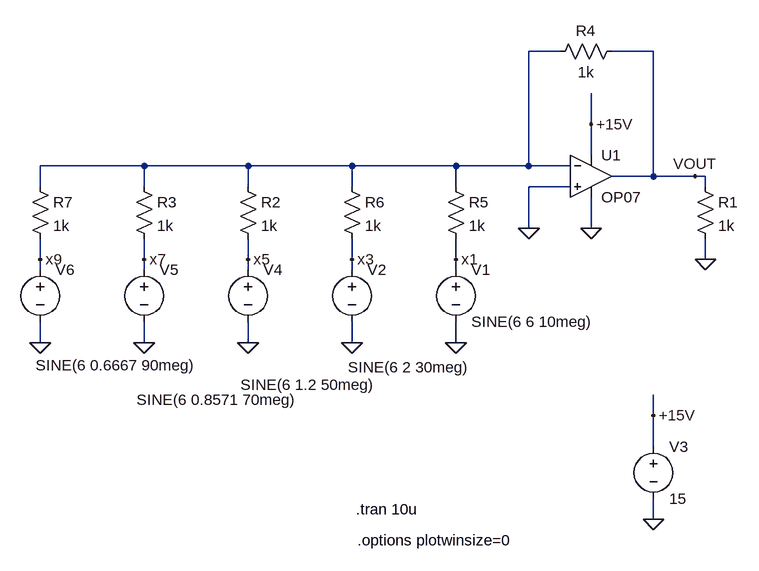
[diagram p0: schematic harmonic_04_pulse-sin.asc]
harmonic_04_pulse-sin.asc, the LTspice schematic file:
Version 4
SHEET 1 880 680
WIRE 128 -240 80 -240
WIRE 272 -240 208 -240
WIRE 176 -128 176 -176
WIRE 176 -80 176 -128
WIRE -512 -64 -672 -64
WIRE -352 -64 -512 -64
WIRE -192 -64 -352 -64
WIRE -32 -64 -192 -64
WIRE 80 -64 80 -240
WIRE 80 -64 -32 -64
WIRE 144 -64 80 -64
WIRE 272 -48 272 -240
WIRE 272 -48 208 -48
WIRE 336 -48 272 -48
WIRE 352 -48 336 -48
WIRE -672 -32 -672 -64
WIRE -512 -32 -512 -64
WIRE -352 -32 -352 -64
WIRE -192 -32 -192 -64
WIRE -32 -32 -32 -64
WIRE 144 -32 80 -32
WIRE 352 -32 352 -48
WIRE 80 32 80 -32
WIRE 176 32 176 -16
WIRE -672 80 -672 48
WIRE -512 80 -512 48
WIRE -352 80 -352 48
WIRE -192 80 -192 48
WIRE -32 80 -32 48
WIRE 352 80 352 48
WIRE -672 96 -672 80
WIRE -512 96 -512 80
WIRE -352 96 -352 80
WIRE -192 96 -192 80
WIRE -32 96 -32 80
WIRE -672 208 -672 176
WIRE -512 208 -512 176
WIRE -352 208 -352 176
WIRE -192 208 -192 176
WIRE -32 208 -32 176
WIRE 272 320 272 288
WIRE 272 368 272 320
WIRE 272 480 272 448
FLAG 352 80 0
FLAG -32 208 0
FLAG -192 208 0
FLAG 80 32 0
FLAG 272 480 0
FLAG -352 208 0
FLAG 176 -128 +15V
FLAG 272 320 +15V
FLAG 176 32 0
FLAG 336 -48 VOUT
FLAG -512 208 0
FLAG -672 208 0
FLAG -32 80 x1
FLAG -192 80 x3
FLAG -352 80 x5
FLAG -512 80 x7
FLAG -672 80 x9
SYMBOL voltage -32 80 R0
WINDOW 123 0 0 Left 0
WINDOW 39 0 0 Left 0
SYMATTR InstName V1
SYMATTR Value SINE(6 6 10meg)
SYMBOL res 336 -48 R0
SYMATTR InstName R1
SYMATTR Value 1k
SYMBOL voltage -192 80 R0
WINDOW 3 -6 166 Left 2
WINDOW 123 0 0 Left 0
WINDOW 39 0 0 Left 0
SYMATTR InstName V2
SYMATTR Value SINE(6 2 30meg)
SYMBOL res 112 -224 R270
WINDOW 0 32 56 VTop 2
WINDOW 3 0 56 VBottom 2
SYMATTR InstName R4
SYMATTR Value 1k
SYMBOL res -48 -48 R0
SYMATTR InstName R5
SYMATTR Value 1k
SYMBOL res -208 -48 R0
SYMATTR InstName R6
SYMATTR Value 1k
SYMBOL Opamps\\OP07 176 -112 R0
SYMATTR InstName U1
SYMBOL voltage 272 352 R0
WINDOW 123 0 0 Left 0
WINDOW 39 0 0 Left 0
SYMATTR InstName V3
SYMATTR Value 15
SYMBOL res -368 -48 R0
SYMATTR InstName R2
SYMATTR Value 1k
SYMBOL voltage -352 80 R0
WINDOW 3 -12 193 Left 2
WINDOW 123 0 0 Left 0
WINDOW 39 0 0 Left 0
SYMATTR InstName V4
SYMATTR Value SINE(6 1.2 50meg)
SYMBOL res -528 -48 R0
SYMATTR InstName R3
SYMATTR Value 1k
SYMBOL voltage -512 80 R0
WINDOW 3 -12 216 Left 2
WINDOW 123 0 0 Left 0
WINDOW 39 0 0 Left 0
SYMATTR InstName V5
SYMATTR Value SINE(6 0.8571 70meg)
SYMBOL res -688 -48 R0
SYMATTR InstName R7
SYMATTR Value 1k
SYMBOL voltage -672 80 R0
WINDOW 3 -7 163 Left 2
WINDOW 123 0 0 Left 0
WINDOW 39 0 0 Left 0
SYMATTR InstName V6
SYMATTR Value SINE(6 0.6667 90meg)
TEXT -186 464 Left 2 !.tran 10u
TEXT -184 512 Left 2 !.options plotwinsize=0

The netlist it stands for:
* harmonic_04_pulse-sin.asc
V1 x1 0 SINE(6 6 10meg)
R1 VOUT 0 1k
V2 x3 0 SINE(6 2 30meg)
R4 N001 VOUT 1k
R5 N001 x1 1k
R6 N001 x3 1k
XU1 0 N001 +15V 0 VOUT LT1001  ; OP07, pins In+ In- V+ V- OUT
V3 +15V 0 15
R2 N001 x5 1k
V4 x5 0 SINE(6 1.2 50meg)
R3 N001 x7 1k
V5 x7 0 SINE(6 0.8571 70meg)
R7 N001 x9 1k
V6 x9 0 SINE(6 0.6667 90meg)
.tran 10u
.options plotwinsize=0
.lib LTC.lib
.backanno
.end